# Altium schematic sheet [5] Relays_Shutdown.SchDoc
size A4
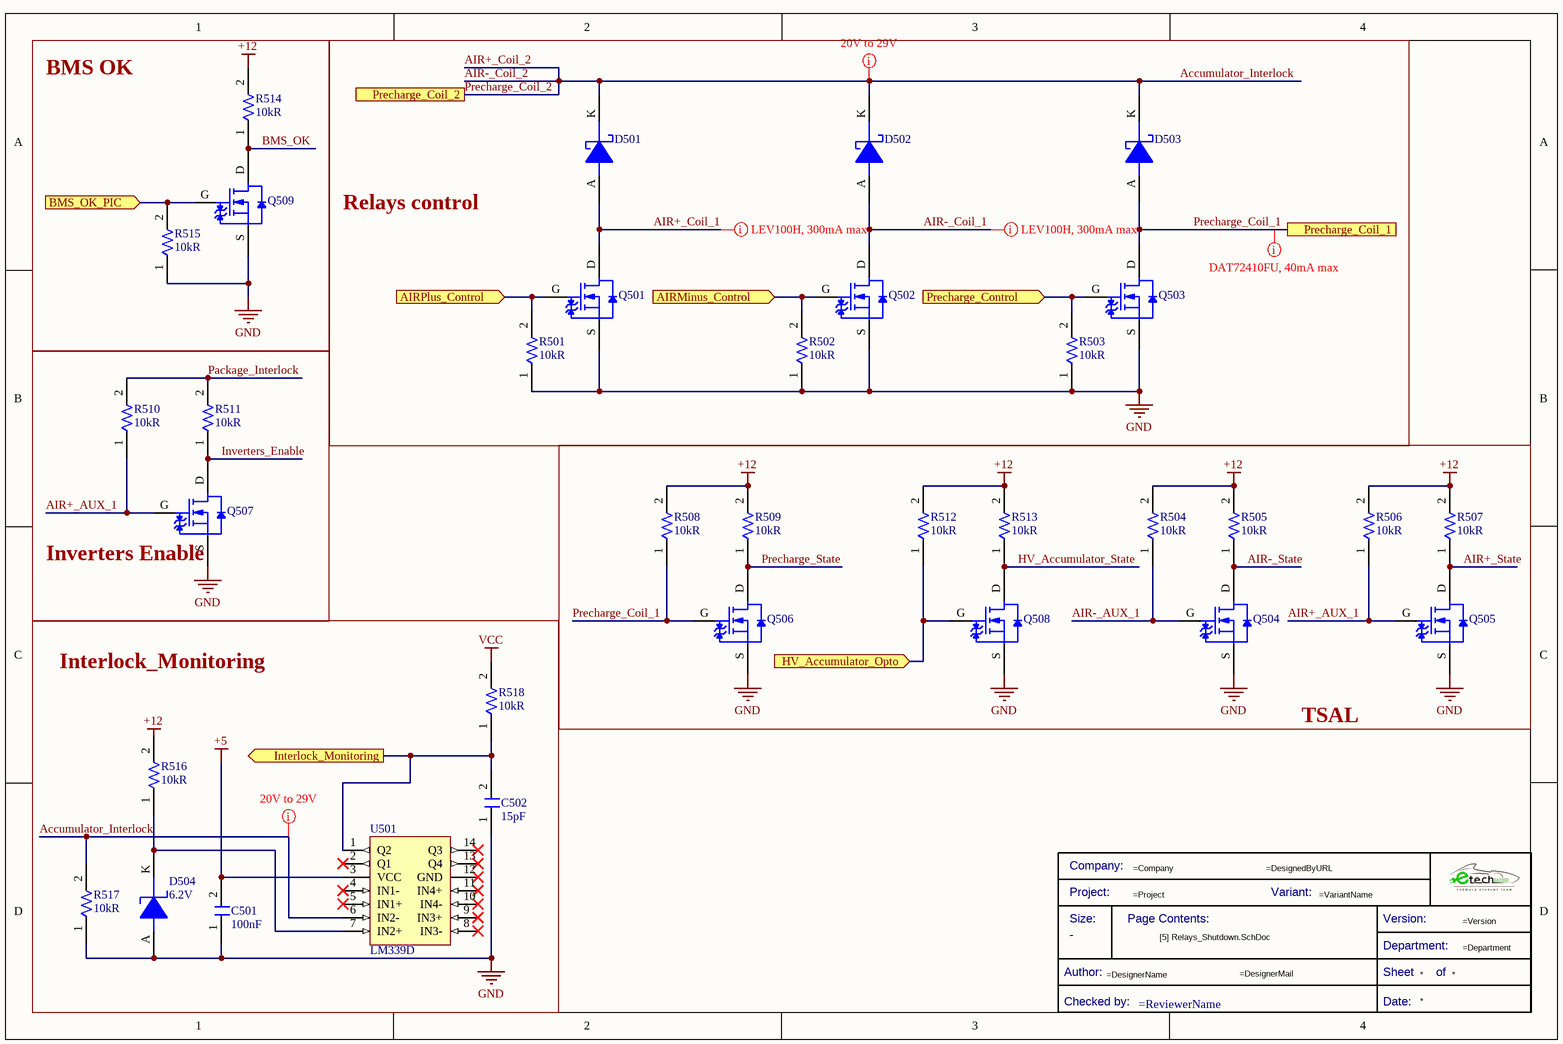
[diagram p0: [5] Relays_Shutdown.SchDoc]

## Parts
*  Title Block_template  (value not drawn)  (graphical)
C501  Capacitance: 100nF  [C0805FNPC-R]  (hidden comment: 885012207098)
C502  Capacitance: 15pF  [C0805FNPC-R]  (hidden comment: 885012007052)
D501  CMDSH05-4 TR PBFREE  [DSC-0.5/40-SOD_323]  (value not drawn)
D502  CMDSH05-4 TR PBFREE  [DSC-0.5/40-SOD_323]  (value not drawn)
D503  CMDSH05-4 TR PBFREE  [DSC-0.5/40-SOD_323]  (value not drawn)
D504  Zener Voltage: 6.2V  (hidden comment: BZG05C6V2-E3-TR)
Q501  CPH3455-TL-H  [TRT-NCH-3/35-CPH]  (value not drawn)
Q502  CPH3455-TL-H  [TRT-NCH-3/35-CPH]  (value not drawn)
Q503  CPH3455-TL-H  [TRT-NCH-3/35-CPH]  (value not drawn)
Q504  CPH3455-TL-H  [TRT-NCH-3/35-CPH]  (value not drawn)
Q505  CPH3455-TL-H  [TRT-NCH-3/35-CPH]  (value not drawn)
Q506  CPH3455-TL-H  [TRT-NCH-3/35-CPH]  (value not drawn)
Q507  CPH3455-TL-H  [TRT-NCH-3/35-CPH]  (value not drawn)
Q508  CPH3455-TL-H  [TRT-NCH-3/35-CPH]  (value not drawn)
Q509  CPH3455-TL-H  [TRT-NCH-3/35-CPH]  (value not drawn)
R501  Resistance: 10kR  [R0805FTK]  (hidden comment: CR0805-JW-103ELF)
R502  Resistance: 10kR  [R0805FTK]  (hidden comment: CR0805-JW-103ELF)
R503  Resistance: 10kR  [R0805FTK]  (hidden comment: CR0805-JW-103ELF)
R504  Resistance: 10kR  [R0805FTK]  (hidden comment: CR0805-JW-103ELF)
R505  Resistance: 10kR  [R0805FTK]  (hidden comment: CR0805-JW-103ELF)
R506  Resistance: 10kR  [R0805FTK]  (hidden comment: CR0805-JW-103ELF)
R507  Resistance: 10kR  [R0805FTK]  (hidden comment: CR0805-JW-103ELF)
R508  Resistance: 10kR  [R0805FTK]  (hidden comment: CR0805-JW-103ELF)
R509  Resistance: 10kR  [R0805FTK]  (hidden comment: CR0805-JW-103ELF)
R510  Resistance: 10kR  [R0805FTK]  (hidden comment: CR0805-JW-103ELF)
R511  Resistance: 10kR  [R0805FTK]  (hidden comment: CR0805-JW-103ELF)
R512  Resistance: 10kR  [R0805FTK]  (hidden comment: CR0805-JW-103ELF)
R513  Resistance: 10kR  [R0805FTK]  (hidden comment: CR0805-JW-103ELF)
R514  Resistance: 10kR  [R0805FTK]  (hidden comment: CR0805-JW-103ELF)
R515  Resistance: 10kR  [R0805FTK]  (hidden comment: CR0805-JW-103ELF)
R516  Resistance: 10kR  [R0805FTK]  (hidden comment: CR0805-JW-103ELF)
R517  Resistance: 10kR  [R0805FTK]  (hidden comment: CR0805-JW-103ELF)
R518  Resistance: 10kR  [R0805FTK]  (hidden comment: CR0805-JW-103ELF)
U501  LM339D  [Array_4_Amp_LM339D]

## Blocks framed on the sheet
BMS OK: Q509 R514 R515
Relays control: D501-D503 Q501-Q503 R501-R503
Inverters Enable: Q507 R510 R511
TSAL: Q504-Q506 Q508 R504-R509 R512 R513
Interlock_Monitoring: C501 C502 D504 R516-R518 U501

## Ports
AIRMinus_Control (in), AIRPlus_Control (in), BMS_OK_PIC (in), HV_Accumulator_Opto (in), Interlock_Monitoring (out), Precharge_Coil_1, Precharge_Coil_2, Precharge_Control (in)

## Nets
+5: C501.2 U501.3(VCC)
+12: R504.2 R505.2 R506.2 R507.2 R508.2 R509.2 R512.2 R513.2 R514.2
GND: C501.1 C502.1 D504.A Q501.S Q502.S Q503.S Q504.S Q505.S Q506.S Q507.S Q508.S Q509.S R501.1 R502.1 R503.1 R515.1 R517.1
VCC: R518.2
Accumulator_Interlock: D501.K D502.K D503.K R517.2 U501.6(IN2-) ; port Precharge_Coil_2  [also labelled AIR+_Coil_2, AIR-_Coil_2, Precharge_Coil_2]
AIR+_AUX_1: Q505.G Q507.G R506.1 R510.1
AIR+_Coil_1: D501.A Q501.D
AIR+_State: Q505.D R507.1
AIR-_AUX_1: Q504.G R504.1
AIR-_Coil_1: D502.A Q502.D
AIR-_State: Q504.D R505.1
AIRMinus_Control: Q502.G R502.2 ; port AIRMinus_Control
AIRPlus_Control: Q501.G R501.2 ; port AIRPlus_Control
BMS_OK: Q509.D R514.1
BMS_OK_PIC: Q509.G R515.2 ; port BMS_OK_PIC
HV_Accumulator_Opto: Q508.G R512.1 ; port HV_Accumulator_Opto
HV_Accumulator_State: Q508.D R513.1
Interlock_Monitoring: C502.2 R518.1 U501.1(Q2) ; port Interlock_Monitoring
Inverters_Enable: Q507.D R511.1
Package_Interlock: R510.2 R511.2
Precharge_Coil_1: D503.A Q503.D Q506.G R508.1 ; port Precharge_Coil_1
Precharge_Control: Q503.G R503.2 ; port Precharge_Control
Precharge_State: Q506.D R509.1
NetD504_K: D504.K R516.1 U501.7(IN2+)

Not connected (* = marked no-connect by the designer): R516 2; U501 2(Q1)* 4(IN1-)* 5(IN1+)* 8(IN3-)* 9(IN3+)* 10(IN4-)* 11(IN4+)* 12(GND)* 13(Q4)* 14(Q3)*

## Layout directives
mark named 20V to 29V: Accumulator_Interlock
mark named LEV100H, 300mA max: AIR+_Coil_1, AIR-_Coil_1
mark named DAT72410FU, 40mA max: Precharge_Coil_1

## Notes on the sheet
- Labels drawn without touching a wire or pin: +12
- Title
- Size:
- Date:
- A4
- Number:
- Time:
- Revision:
- Sheet
- of
- File:
- (in symbol Title Block_template) Company:; Project:; Variant:; Size:; Page Contents:; Version:; Department:; Author:; Sheet; of; Checked by:; Date:

## Library data of the parts
* = Title Block_template: Standard Title Block; Category: Title Block; Checked by:: =ReviewerName; Size: -
C501 = C100n-50V-0805FNPC-X7R: Cap, 0.1ΜF, 50V, 10%, X7R, 0805; Manufacturer 1: Wurth Electronics; .Creator: DR; Supplier 1: RSComponents; Manufacturer Part Number 1: 885012207098; RoHS: Yes; Category: Ceramic Capacitors; Stock 1: 8000; Pricing 1: 100=0,10200, 500=0,07100, 2000=0,06100 (GBP); Mount: Surface Mount; Case/Package: 0805; Case Code (Metric): 2012; Case Code (Imperial): 0805; Min Operating Temperature: -55°C; Max Operating Temperature: 125°C; Packaging: Cut Tape; Voltage Rating: 50V; Dielectric: X7R; Tolerance: 10%; Voltage Rating (DC): 50V; Length: 0.079inch; Width: 0.049inch; Thickness: 0.035inch; REACH SVHC: Unknown; RoHS Compliant: Yes; ComponentLink1URL: http://www.farnell.com/datasheets/1958498.pdf?src-supplier=Farnell; ComponentLink1Description: http://www.farnell.com/datasheets/1958498.pdf?src-supplier=Farnell; ComponentLink2URL: http://www.farnell.com/datasheets/1958498.pdf?src-supplier=Element14; ComponentLink2Description: http://www.farnell.com/datasheets/1958498.pdf?src-supplier=Element14; ComponentLink3URL: https://katalog.we-online.de/pbs/datasheet/885012207098.pdf?src-supplier=Digi-Key; ComponentLink3Description: https://katalog.we-online.de/pbs/datasheet/885012207098.pdf?src-supplier=Digi-Key; ComponentLink4URL: http://www.farnell.com/datasheets/1958498.pdf?src-supplier=Newark; ComponentLink4Description: http://www.farnell.com/datasheets/1958498.pdf?src-supplier=Newark; Supplier Part Number 1: 1813493
C502 = C15p-50V-0805FNPC-NP0: Cap, 15PF, 50V, 5%, C0G/NP0, 0805; Manufacturer 1: Wurth Electronics; .Creator: DR; Supplier 1: Newark; Manufacturer Part Number 1: 885012007052; RoHS: Yes; Category: Ceramic Capacitors; Stock 1: 815; Pricing 1: 1=0,10800, 10=0,05200, 25=0,05100, 50=0,04900, 100=0,04800, 250=0,04600, 500=0,04300 (USD); Mount: Surface Mount; Case/Package: 0805; Case Code (Metric): 2012; Case Code (Imperial): 0805; Min Operating Temperature: -55°C; Max Operating Temperature: 125°C; Packaging: Cut Tape; Voltage Rating: 50V; Tolerance: 5%; Length: 0.079inch; Width: 0.049inch; Thickness: 0.028inch; RoHS Compliant: Yes; ComponentLink1URL: http://www.farnell.com/datasheets/2031702.pdf?src-supplier=Farnell; ComponentLink1Description: http://www.farnell.com/datasheets/2031702.pdf?src-supplier=Farnell; ComponentLink2URL: http://katalog.we-online.de/pbs/datasheet/885012007052.pdf?src-supplier=Digi-Key; ComponentLink2Description: http://katalog.we-online.de/pbs/datasheet/885012007052.pdf?src-supplier=Digi-Key; ComponentLink3URL: https://katalog.we-online.de/pbs/datasheet/885012007052.pdf?src-supplier=Digi-Key; ComponentLink3Description: https://katalog.we-online.de/pbs/datasheet/885012007052.pdf?src-supplier=Digi-Key; Supplier Part Number 1: 15AC9316
D501-D503 = DSC-0.5/40-SOD_323: CMDSH Series 40 V 500 mA Surface Mount Schottky Diode - SOD-323; Manufacturer: Central Semiconductor; Forward Voltage: 470mV; Average Rectified Current: 500mA; Peak Non-Repetitive Surge Current: 10A; Max Repetitive Reverse Voltage (Vrrm): 40V; Max Reverse Current: 100uA; Power Dissipation: 250mW; Element Configuration: Single; .Creator: GP; Category: Diode; ComponentLink1Description: Datasheet; ComponentLink1URL: https://my.centralsemi.com/datasheets/CMDSH05-4.PDF; ComponentLink2Description: Where buy it; ComponentLink2URL: https://eu.mouser.com/ProductDetail/Central-Semiconductor/CMDSH05-4-TR-PBFREE?qs=u16ybLDytRZ65hpUpJcxrg%3D%3D; Supplier 1: Digi-Key; Manufacturer Part Number: CMDSH05-4TR; RoHS: No; Pricing 1: 1=0,39000, 10=0,32000, 100=0,21790, 500=0,16342, 1000=0,12256 (USD); Mount: Surface Mount; Number of Pins: 2; Weight: 0.001164oz; Min Operating Temperature: -65°C; Max Operating Temperature: 150°C; Packaging: Tape and Reel; Termination: SMD/SMT; Forward Current: 500mA; Max Forward Surge Current (Ifsm): 10A; Max Power Dissipation: 250mW; Package Quantity: 3000; Max Reverse Voltage (DC): 40V; Series: -; Length: 1.8mm; Width: 1.35mm; Height: 1mm; Radiation Hardening: No; RoHS Compliant: No; Lead Free: Lead Free; Supplier Part Number 1: 1514-CMDSH05-4TRPBFREEDKR-ND
D504 = DZ-6.2V-DO-214AC: BZG05C Series 6.2 V 200 mA Surface Mount Zener Diode - DO-214AC; Manufacturer 1: Vishay Semiconductors; Max Power Dissipation: 1.25W; Impedance: 4R; Max Reverse Leakage Current: 1uA; Tolerance: 5%; Test Current: 35mA; .Creator: DO; ComponentLink1Description: Datasheet; ComponentLink1URL: http://www.mouser.com/ds/2/427/bzg05c-710097.pdf?src-supplier=Mouser; ComponentLink2Description: Where buy it; ComponentLink2URL: https://www.mouser.es/ProductDetail/Vishay-Semiconductors/BZG05C6V2-E3-TR?qs=PhR8RmCirEbIeyTQuBsADg%3D%3D; Supplier 1: Farnell; Manufacturer Part Number 1: BZG05C6V2-E3-TR; RoHS: Yes; Category: Zener Diodes; Pricing 1: 1=0,06810 (GBP); Mount: Surface Mount; Number of Pins: 2; Contact Plating: Tin,Matte; Min Operating Temperature: -65°C; Max Operating Temperature: 150°C; Packaging: Tape and Reel; RoHS Compliant: Yes; Lead Free: Lead Free; ComponentLink3URL: http://www.mouser.com/ds/2/427/bzg05c-710097.pdf?src-supplier=Mouser; ComponentLink3Description: http://www.mouser.com/ds/2/427/bzg05c-710097.pdf?src-supplier=Mouser; ComponentLink4URL: http://www.vishay.com/docs/85893/bzg05c.pdf?src-supplier=Avnet; ComponentLink4Description: http://www.vishay.com/docs/85893/bzg05c.pdf?src-supplier=Avnet; ComponentLink5URL: http://www.vishay.com/docs/85893/bzg05c.pdf?src-supplier=Digi-Key; ComponentLink5Description: http://www.vishay.com/docs/85893/bzg05c.pdf?src-supplier=Digi-Key; Supplier Part Number 1: 2690001
Q501-Q509 = TRT-NCH-3/35-CPH: CPH3455-TL-H N-channel MOSFET Transistor; 3 A; 35 V; 3-Pin CPH; Manufacturer: ON Semiconductor; Rds On Max: 104mR; Input Capacitance: 186pF; Rise Time: 4.7ns; Drain to Source Voltage (Vdss): 35V; Continuous Drain Current (ID): 3A; Max Power Dissipation: 1W; Drain to Source Resistance: 108mR; Turn-On Delay Time: 4.2ns; Turn-Off Delay Time: 15ns; Fall Time: 5.7ns; Element Configuration: Single; Gate to Source Voltage (Vgs): 20V; .Creator: GP; Category: Transistor; ComponentLink1Description: Datasheet; ComponentLink1URL: https://docs.rs-online.com/5847/0900766b812d514d.pdf; ComponentLink2Description: Where buy it; ComponentLink2URL: https://es.rs-online.com/web/p/mosfet/8009989; Supplier 1: RSComponents; Manufacturer Part Number: CPH3455-TL-H; RoHS: Yes; Stock 1: 1; Pricing 1: 50=0,50400 (USD); Case/Package: SC; Number of Pins: 3; Min Operating Temperature: -55°C; Max Operating Temperature: 150°C; Package Quantity: 3000; Packaging: Tape and Reel; Drain to Source Breakdown Voltage: 35V; Power Dissipation: 1W; Polarity: N-CHANNEL; Series: -; Length: 2.9mm; Width: 1.6mm; Height: 0.9mm; Lead Free: Lead Free; Halogen Free: Halogen Free; RoHS Compliant: Yes; ComponentLink3URL: https://datasheet.ciiva.com/947/cph3455-d-947201.pdf?src-supplier=Digi-Key; ComponentLink3Description: https://datasheet.ciiva.com/947/cph3455-d-947201.pdf?src-supplier=Digi-Key; ComponentLink4URL: https://datasheet.ciiva.com/4444/cph3455-d-91653-4444616.pdf?src-supplier=Mouser; ComponentLink4Description: https://datasheet.ciiva.com/4444/cph3455-d-91653-4444616.pdf?src-supplier=Mouser; ComponentLink5URL: https://datasheet.ciiva.com/11164/cph3455-d-11164889.pdf?src-supplier=Avnet; ComponentLink5Description: https://datasheet.ciiva.com/11164/cph3455-d-11164889.pdf?src-supplier=Avnet; Supplier Part Number 1: 8009989
R501-R518 = R10k-0805FTK: BOURNS         CR0805-JW-103ELF            Surface Mount Chip Resistor, Thick Film, CR Series, 10 kohm, 125 mW,  5%, 150 V; Temperature Coefficient: 200ppm/°C; Power Rating: 125mW; Voltage Rating: 150V; Voltage Rating (DC): 100V; .Creator: DR; Supplier 1: Arrow Electronics; Manufacturer 1: Bourns; Manufacturer Part Number 1: CR0805-JW-103ELF; RoHS: Yes; Category: Chip SMD Resistors; Stock 1: 57566; Pricing 1: 1=0,05790, 10=0,01540, 25=0,01340, 100=0,00340 (USD); Mount: Surface Mount; Case/Package: 0805; Number of Pins: 2; Contact Plating: Tin; Case Code (Metric): 2012; Case Code (Imperial): 0805; Min Operating Temperature: -55°C; Max Operating Temperature: 155°C; Tolerance: 5%; Resistor Type: Thick Film; Package Quantity: 1; Packaging: Tape and Reel; Number of Terminations: 2; Termination: SMD/SMT; Max Power Dissipation: 125mW; Features: Moisture Resistant; Series: CR0805; Construction: Rectangular; Resistance Tolerance: 5%; Technology: THICK FILM; Length: 2mm; Width: 1.25mm; Height: 0.5mm; Depth: 1.25mm; Thickness: 508um; Radiation Hardening: No; REACH SVHC: No SVHC; Military Standard: Not; RoHS Compliant: Yes; ComponentLink1URL: https://datasheet.ciiva.com/11821/0900766b80fcdb72-11821135.pdf?src-supplier=RSComponents; ComponentLink1Description: https://datasheet.ciiva.com/11821/0900766b80fcdb72-11821135.pdf?src-supplier=RSComponents; ComponentLink2URL: https://datasheet.ciiva.com/9122/chpreztr-9122374.pdf?src-supplier=Avnet; ComponentLink2Description: https://datasheet.ciiva.com/9122/chpreztr-9122374.pdf?src-supplier=Avnet; ComponentLink3URL: https://datasheet.ciiva.com/22693/1902866-22693254.pdf?src-supplier=Element14; ComponentLink3Description: https://datasheet.ciiva.com/22693/1902866-22693254.pdf?src-supplier=Element14; ComponentLink4URL: https://datasheet.ciiva.com/7986/691949-7986187.pdf?src-supplier=Element14; ComponentLink4Description: https://datasheet.ciiva.com/7986/691949-7986187.pdf?src-supplier=Element14; ComponentLink5URL: https://datasheet.ciiva.com/30065/159chpreztr-30065976.pdf?src-supplier=Onlinecomponents.com; ComponentLink5Description: https://datasheet.ciiva.com/30065/159chpreztr-30065976.pdf?src-supplier=Onlinecomponents.com; ComponentLink6URL: https://datasheet.ciiva.com/16783/70154685-16783482.pdf?src-supplier=Allied+Electronics; ComponentLink6Description: https://datasheet.ciiva.com/16783/70154685-16783482.pdf?src-supplier=Allied+Electronics; ComponentLink7URL: https://datasheet.ciiva.com/5548/chpreztr-5548491.pdf?src-supplier=Mouser; ComponentLink7Description: https://datasheet.ciiva.com/5548/chpreztr-5548491.pdf?src-supplier=Mouser; ComponentLink8URL: https://datasheet.ciiva.com/6559/chpreztr-6559900.pdf?src-supplier=Digi-Key; ComponentLink8Description: https://datasheet.ciiva.com/6559/chpreztr-6559900.pdf?src-supplier=Digi-Key; ComponentLink9URL: https://datasheet.ciiva.com/6559/chpreztr-6559901.pdf?src-supplier=Digi-Key; ComponentLink9Description: https://datasheet.ciiva.com/6559/chpreztr-6559901.pdf?src-supplier=Digi-Key; ComponentLink10URL: https://datasheet.ciiva.com/7985/1856384-7985869.pdf?src-supplier=Element14; ComponentLink10Description: https://datasheet.ciiva.com/7985/1856384-7985869.pdf?src-supplier=Element14; ComponentLink11URL: https://datasheet.ciiva.com/48692/001055517-da-01-en-smd-wid-cr0805-jw-103elf-10k-ohm-1-8w-48692118.pdf?src-supplier=Conrad; ComponentLink11Description: https://datasheet.ciiva.com/48692/001055517-da-01-en-smd-wid-cr0805-jw-103elf-10k-ohm-1-8w-48692118.pdf?src-supplier=Conrad; Supplier Part Number 1: CR0805-JW-103ELF
U501 = Array_4_Amp_LM339D: Comparator Quad ±18V/36V 14-Pin SOIC Tube; Manufacturer: Texas Instruments; Number of Channels: 4; Nominal Supply Current: 2mA; Output Current: 20mA; Quiescent Current: 2.5mA; Max Supply Voltage: 30V; Min Supply Voltage: 2V; Min Dual Supply Voltage: 1V; Max Dual Supply Voltage: 15V; Voltage Gain: 106.02dB; Max Supply Current: 500uA; Input Bias Current: 250nA; Output Current per Channel: 6mA; Input Offset Voltage (Vos): 5mV; Response Time: 0.3us; Output Type: TTL; Dual Supply Voltage: 9V; .Creator: DO; Supplier 1: Digi-Key; RoHS: Yes; Category: Amplifiers - Op Amps, Buffer, Instrumentation; Stock 1: 10834; Pricing 1: 1=0,93000, 10=0,83500, 25=0,79240, 100=0,65090, 250=0,60848, 500=0,53774, 1000=0,46725 (USD); Mount: Surface Mount; Case/Package: SOIC; Number of Pins: 14; Contact Plating: Gold; Weight: 0.004318oz; Min Operating Temperature: 0°C; Max Operating Temperature: 70°C; Packaging: Rail/Tube; Package Quantity: 50; Number of Elements: 4; Supply Current: 2mA; Technology: BIPOLAR; Max Input Current: 250nA; Series: LM339; Length: 8.65mm; Width: 3.91mm; Height: 1.58mm; Radiation Hardening: No; REACH SVHC: No SVHC; Lead Free: Lead Free; RoHS Compliant: Yes; ComponentLink1URL: https://datasheet.ciiva.com/15131/getdatasheetpartid-248452-15131099.pdf?src-supplier=Verical; ComponentLink1Description: https://datasheet.ciiva.com/15131/getdatasheetpartid-248452-15131099.pdf?src-supplier=Verical; ComponentLink2URL: https://datasheet.ciiva.com/1483/1831045-1483000.pdf?src-supplier=Element14; ComponentLink2Description: https://datasheet.ciiva.com/1483/1831045-1483000.pdf?src-supplier=Element14; ComponentLink3URL: https://datasheet.ciiva.com/1827/lm139a-1827534.pdf?src-supplier=Digi-Key; ComponentLink3Description: https://datasheet.ciiva.com/1827/lm139a-1827534.pdf?src-supplier=Digi-Key; ComponentLink4URL: https://datasheet.ciiva.com/2970/lm2901-2970484.pdf?src-supplier=Avnet; ComponentLink4Description: https://datasheet.ciiva.com/2970/lm2901-2970484.pdf?src-supplier=Avnet; ComponentLink5URL: https://datasheet.ciiva.com/48712/001010753-da-01-en-ic-quad-diff-comp-lm339d-soic-14-tid-48712470.pdf?src-supplier=Conrad; ComponentLink5Description: https://datasheet.ciiva.com/48712/001010753-da-01-en-ic-quad-diff-comp-lm339d-soic-14-tid-48712470.pdf?src-supplier=Conrad; Supplier Part Number 1: 296-1013-5-ND; ComponentLink6Description: Where buy it; ComponentLink6URL: https://es.rs-online.com/web/p/comparadores/0858411; Manufacturer Part Number: LM339D